# EAGLE design 2l-impedance-coupon-22-6 (EAGLE 9.6.1)
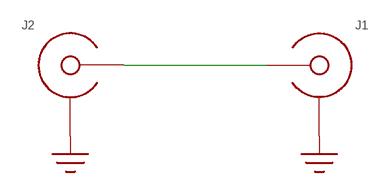
[diagram p0: schematic, sheet 1]

## Parts
J1  SMA-EDGE-LAUNCH  [SMA_EDGE_LAUNCH_4L_4020_TAPER_22]
J2  SMA-EDGE-LAUNCH  [SMA_EDGE_LAUNCH_4L_4020_TAPER_22]

## Nets
GND: J1.BOTTOM_GND(SHIELD) J1.GND@1(SHIELD) J1.GND@2(SHIELD) J1.GND@3(SHIELD) J1.GND@4(SHIELD) J1.GND@5(SHIELD) J1.GND@6(SHIELD) J1.GND@7(SHIELD) J1.GND@8(SHIELD) J1.GND@14(SHIELD) J1.GND@15(SHIELD) J1.GND@16(SHIELD) J1.GND@17(SHIELD) J1.GND_PAD1(SHIELD) J1.GND_PAD2(SHIELD) J1.P$1(SHIELD) J1.P$2(SHIELD) J1.P$4(SHIELD) J1.P$5(SHIELD) J2.BOTTOM_GND(SHIELD) J2.GND@1(SHIELD) J2.GND@2(SHIELD) J2.GND@3(SHIELD) J2.GND@4(SHIELD) J2.GND@5(SHIELD) J2.GND@6(SHIELD) J2.GND@7(SHIELD) J2.GND@8(SHIELD) J2.GND@14(SHIELD) J2.GND@15(SHIELD) J2.GND@16(SHIELD) J2.GND@17(SHIELD) J2.GND_PAD1(SHIELD) J2.GND_PAD2(SHIELD) J2.P$1(SHIELD) J2.P$2(SHIELD) J2.P$4(SHIELD) J2.P$5(SHIELD)
N$1 [22-6]: J1.CENTER@1(CENTER) J1.P$3(CENTER) J2.CENTER@1(CENTER) J2.P$3(CENTER)

## Library data of the parts
J1 J2 = yapo:SMA-EDGE-LAUNCH

## Board
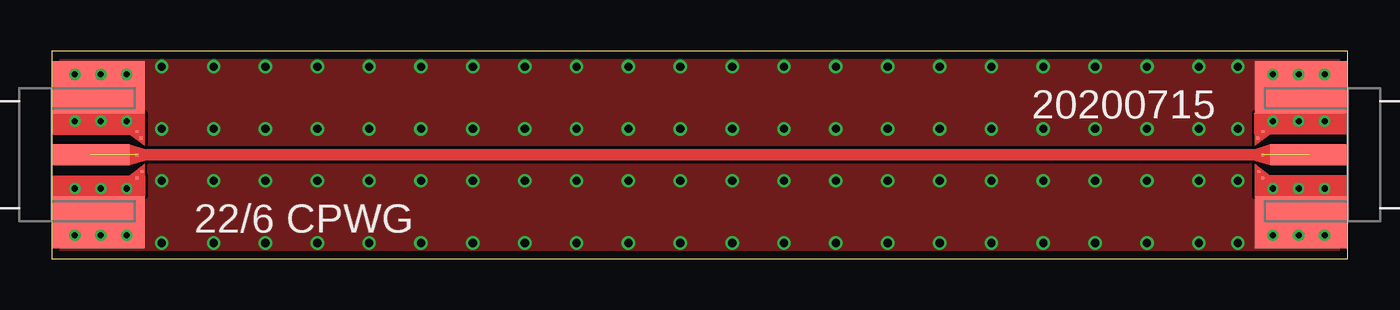
[diagram p1: board, top side]
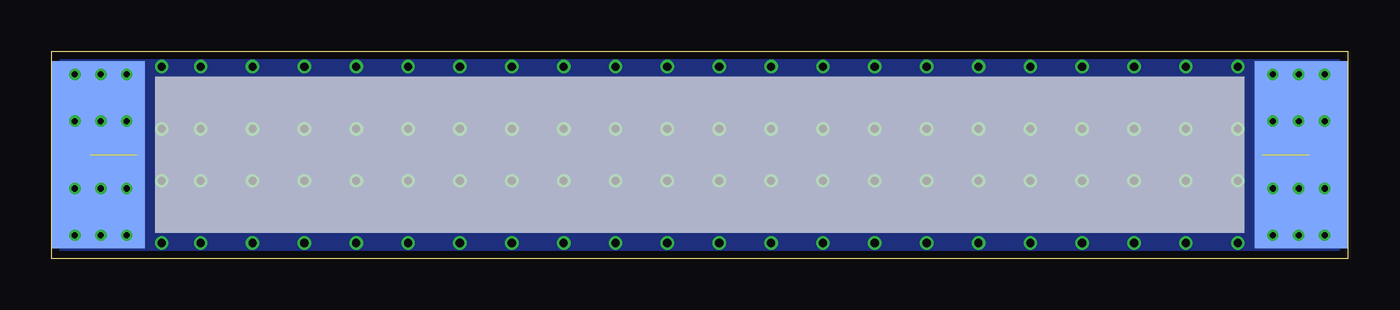
[diagram p2: board, bottom side, seen from below]

Size 63.5 x 10.16 mm. Coordinates in mm from the lower left corner, seen from the top.
Outline: 0,0 63.5,0 63.5,10.16 0,10.16 0,0
Copper layers (1*16): Top 0.035559375mm / dielectric 1.6mm / Bottom 0.035559375mm
Design rules "oshpark-2layer *": minimum track width 6mil, minimum drill 10mil, track to track 6mil, track to pad 6mil, pad to pad 6mil, via to via 6mil, smd to smd 6mil, copper to edge 15mil, drill to drill 6mil, minimum pad ring 5mil, minimum via ring 5mil, stop-mask expansion 2.5mil, vias tented up to drill 20mil, thermal gap 10mil

### Footprints (pad centres in the part's own frame; a part is rotated, then mirrored left to right if it is on the bottom)
SMA_EDGE_LAUNCH_4L_4020_TAPER_22 = smd 4.572 x 9.144 bottom: BOTTOM_GND 2.286,0 | smd 3.81 x 1.016: CENTER@1 1.905,0 | drill 0.3: GND@1 1.143,3.937; GND@2 3.683,3.937; GND@3 1.143,1.651; GND@4 3.683,1.651; GND@5 1.143,-1.651; GND@6 3.683,-1.651; GND@7 1.143,-3.937; GND@8 3.683,-3.937; GND@14 2.413,3.937; GND@15 2.413,-3.937; GND@16 2.413,-1.651; GND@17 2.413,1.651 | smd 4.572 x 2.54: GND_PAD1 2.286,3.302; GND_PAD2 2.286,-3.302 | smd 0.127 x 0.127: P$1 4.191,1.143; P$2 4.191,-1.143; P$3 4.191,0; P$4 4.42,-0.813; P$5 4.369,0.813

### Placement (x,y rotation side)
J1  63.5,5.08 180 top
J2  0,5.08 0 top

### Tracks (layer width: path | path; a pad name or v marks a point on that pad's centre or on a via)
GND  (via drill 0.4)
  other vias: 5.4,9.4 7.94,9.4 10.48,9.4 13.02,9.4 15.56,9.4 18.1,9.4 20.64,9.4 23.18,9.4 25.72,9.4 28.26,9.4 30.8,9.4 33.34,9.4 35.88,9.4 38.42,9.4 40.96,9.4 43.5,9.4 46.04,9.4 48.58,9.4 51.12,9.4 53.66,9.4 56.2,9.4 58.1,9.4 5.4,6.35 7.94,6.35 10.48,6.35 13.02,6.35 15.56,6.35 18.1,6.35 20.64,6.35 23.18,6.35 25.72,6.35 28.26,6.35 30.8,6.35 33.34,6.35 35.88,6.35 38.42,6.35 40.96,6.35 43.5,6.35 46.04,6.35 48.58,6.35 51.12,6.35 53.66,6.35 56.2,6.35 5.4,3.81 7.94,3.81 10.48,3.81 13.02,3.81 15.56,3.81 18.1,3.81 20.64,3.81 23.18,3.81 25.72,3.81 28.26,3.81 30.8,3.81 33.34,3.81 35.88,3.81 38.42,3.81 40.96,3.81 43.5,3.81 46.04,3.81 48.58,3.81 51.12,3.81 53.66,3.81 56.2,3.81 58.1,6.35 58.1,3.81 5.4,0.76 7.94,0.76 10.48,0.76 13.02,0.76 15.56,0.76 18.1,0.76 20.64,0.76 23.18,0.76 25.72,0.76 28.26,0.76 30.8,0.76 33.34,0.76 35.88,0.76 38.42,0.76 40.96,0.76 43.5,0.76 46.04,0.76 48.58,0.76 51.12,0.76 53.66,0.76 56.2,0.76 58.1,0.76
  pour Top (no thermals): 0,0 63.5,0 63.5,10.16 0,10.16
  pour Bottom (no thermals): 0,0 63.5,0 63.5,10.16 0,10.16
N$1  (2 unrouted)
  Top 0.559: J2.CENTER@1 44.45,5.08 J1.CENTER@1

### Text on the board
tPlace: 20200715 | 22/6 CPWG